# Altium schematic sheet swr-antenna.SchDoc
size A4; SheetNumber: 5; SheetTotal: 5
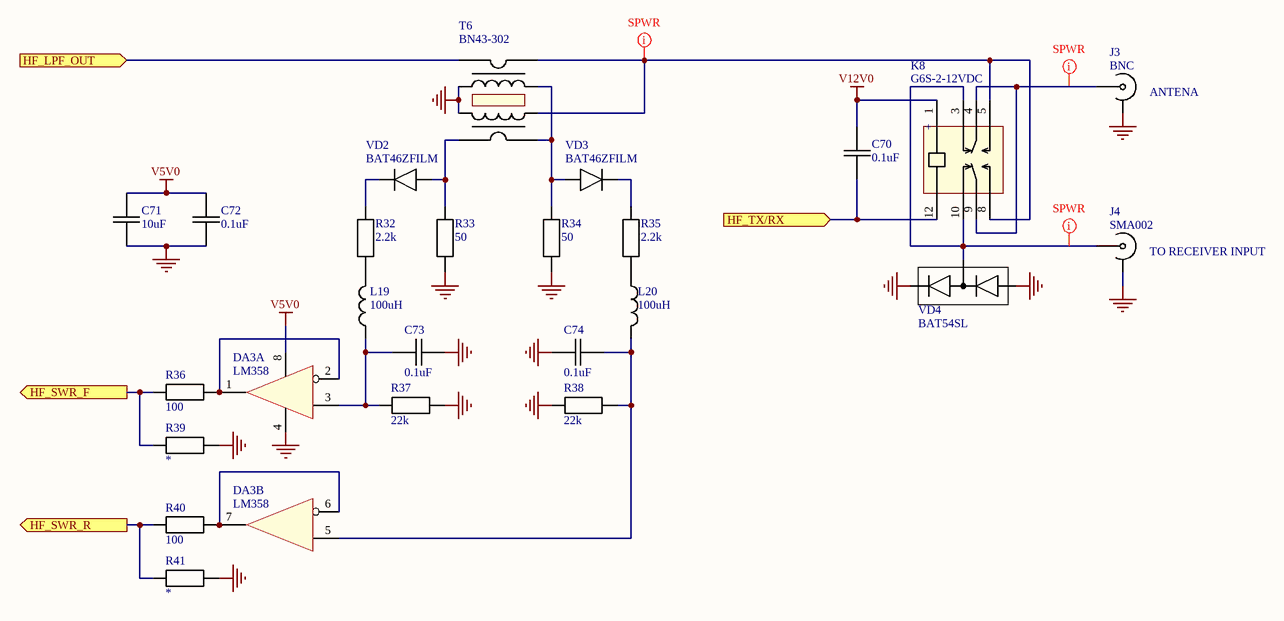
[diagram p0: swr-antenna.SchDoc]

## Parts
C70  0.1uF  [CAPC2013X100N]
C71  10uF  [CAPC2013X100N]
C72  0.1uF  [CAPC2013X100N]
C73  0.1uF  [CAPC2013X100N]
C74  0.1uF  [CAPC2013X100N]
DA3  LM358  [SOIC127P600X175-8N]  (parts A,B of 2)
J3  BNC  [BNC-TYCO_1-1337542-0]
J4  SMA002  [SMA002]
K8  G6S-2-12VDC  [G6S-2]
L19  100uH  [INDUCTOR-1008]
L20  100uH  [INDUCTOR-1008]
R32  2.2k  [RESC2013X64N]
R33  50  [RESC2013X64N]
R34  50  [RESC2013X64N]
R35  2.2k  [RESC2013X64N]
R36  100  [RESC2013X64N]
R37  22k  [RESC2013X64N]
R38  22k  [RESC2013X64N]
R39  *  [RESC2013X64N]
R40  100  [RESC2013X64N]
R41  *  [RESC2013X64N]
T6  BN43-302  [TANDEM]
VD2  BAT46ZFILM  [SOD3816X118N]
VD3  BAT46ZFILM  [SOD3816X118N]
VD4  BAT54SL  [SOT95P229X119-3N]

## Ports
HF_LPF_OUT (in), HF_SWR_F (out), HF_SWR_R (out), HF_TX/RX (in)

## Nets
GND: C71.1 C72.1 C73.2 C74.1 DA3.4(GND) J3.2(GND) J4.2(GND) R33.1 R34.1 R37.1 R38.2 R39.1 R41.1 T6.3 T6.5 VD4.1(A) VD4.2(C)
V5V0: C71.2 C72.2 DA3.8(VCC)
V12V0: C70.2 K8.1
HF_LPF_OUT: T6.1 ; port HF_LPF_OUT
HF_SWR_F: R36.2 R39.2 ; port HF_SWR_F
HF_SWR_R: R40.2 R41.2 ; port HF_SWR_R
HF_TX/RX: C70.1 K8.12 ; port HF_TX/RX
NetC73_1: C73.1 DA3.3(IN1+) L19.1 R37.2
NetC74_2: C74.2 DA3.5(IN2+) L20.2 R38.1
NetDA3_1: DA3.1(OUT1) DA3.2(IN1-) R36.1
NetDA3_6: DA3.6(IN2-) DA3.7(OUT2) R40.1
NetJ3_1: J3.1(RF) K8.4 K8.9
NetJ4_1: J4.1(RF) K8.3 K8.10 VD4.3(AC)
NetK8_5: K8.5 K8.8 T6.2 T6.6
NetL19_2: L19.2 R32.1
NetL20_1: L20.1 R35.1
NetR32_2: R32.2 VD2.1(C)
NetR33_2: R33.2 T6.7 VD2.2(A)
NetR34_2: R34.2 T6.4 T6.8 VD3.2(A)
NetR35_2: R35.2 VD3.1(C)

## Layout directives
net class OutPowerNet: NetJ3_1, NetJ4_1, NetK8_5

## Notes on the sheet
- (near J3) ANTENA
- (near J4) TO RECEIVER INPUT
- (in symbol G6S-2-12VDC) +

## Library data of the parts
C70-C74 = Cap0805: Capacitor 2x1.25 mm
DA3 = LM358: Single Supply Dual / Operational Amplifiers
J3 = RF Connector: EM-BC028M-NGP-50
J4 = RF Connector
K8 = G6S-2-12VDC: Compact, Industry-Standard 2-pole relay
L19 L20 = Inductor: SWI1008HT101K-Hitano
R32-R41 = Res0805
T6 = tandem match
VD2 VD3 = DIODE: Small signal Schottky diodes / imrad; pin to pad: 1>2
VD4 = DIODE-2-1A-3C-3A-2C